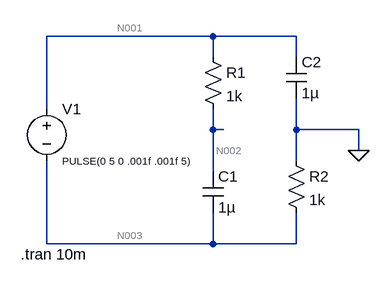
[diagram p0: schematic F_DC.asc]
F_DC.asc, the LTspice schematic file:
Version 4
SHEET 1 880 680
WIRE 352 16 96 16
WIRE 480 16 352 16
WIRE 352 48 352 16
WIRE 480 48 480 16
WIRE 96 128 96 16
WIRE 352 160 352 128
WIRE 368 160 352 160
WIRE 480 160 480 112
WIRE 576 160 480 160
WIRE 576 192 576 160
WIRE 480 208 480 160
WIRE 352 224 352 160
WIRE 96 336 96 208
WIRE 352 336 352 288
WIRE 352 336 96 336
WIRE 480 336 480 288
WIRE 480 336 352 336
FLAG 576 192 0
SYMBOL voltage 96 112 R0
WINDOW 123 0 0 Left 0
WINDOW 39 0 0 Left 0
WINDOW 3 24 96 Left 1
SYMATTR InstName V1
SYMATTR Value PULSE(0 5 0 .001f .001f 5)
SYMBOL res 336 32 R0
SYMATTR InstName R1
SYMATTR Value 1k
SYMBOL cap 336 224 R0
SYMATTR InstName C1
SYMATTR Value 1µ
SYMBOL cap 464 48 R0
SYMATTR InstName C2
SYMATTR Value 1µ
SYMBOL res 464 192 R0
SYMATTR InstName R2
SYMATTR Value 1k
TEXT 56 352 Left 2 !.tran 10m

The netlist it stands for:
* F_DC.asc
V1 N001 N003 PULSE(0 5 0 .001f .001f 5)
R1 N001 N002 1k
C1 N002 N003 1µ
C2 N001 0 1µ
R2 0 N003 1k
.tran 10m
.backanno
.end

* Results of the author's LTspice run, read from the files saved beside the schematic
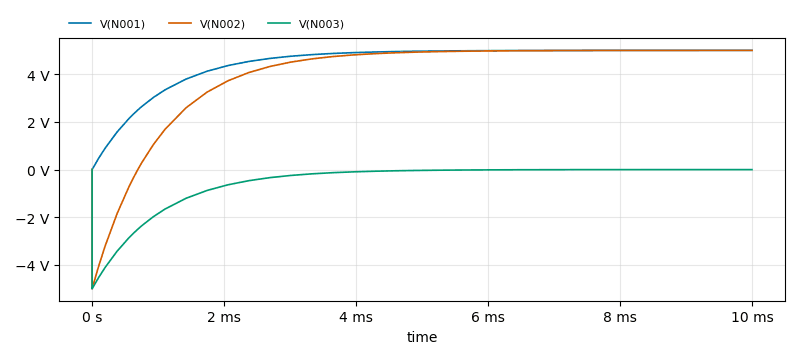
[diagram p1: Transient Analysis of F_DC.asc, plotted from the saved traces]
* Transient Analysis, 1 run:
*   V(N001): min 0 V, max 5 V, average 4.498 V, rms 4.609 V, last 5 V
*   V(N002): min -5 V, max 5 V, average 3.996 V, rms 4.473 V, last 5 V
*   V(N003): min -5 V, max 0 V, average -502 mV, rms 1.123 V, last -227 µV